# EAGLE schematic Fiducial (EAGLE 7.3.0)
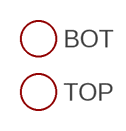
[diagram p0: schematic, sheet 1]

## Parts
BOT  FIDUCIAL  [FIDUCIAL_1MM]
TOP  FIDUCIAL  [FIDUCIAL_1MM]

## Library data of the parts
BOT TOP = Modulo:FIDUCIAL; BOM: EXCLUDE